# Altium schematic sheet SPI-UART.schdoc
size 497 x 243 mm; Name: A_A4; Symbol: A_A4; Device: A_A4; @Project Name: G031J6M6; REV: 1.0; Date: 2021-07-21; Sheet: 1/1; Draw By: timp2100; Company: BUAA; Convert to PCB: yes; Add into BOM: yes
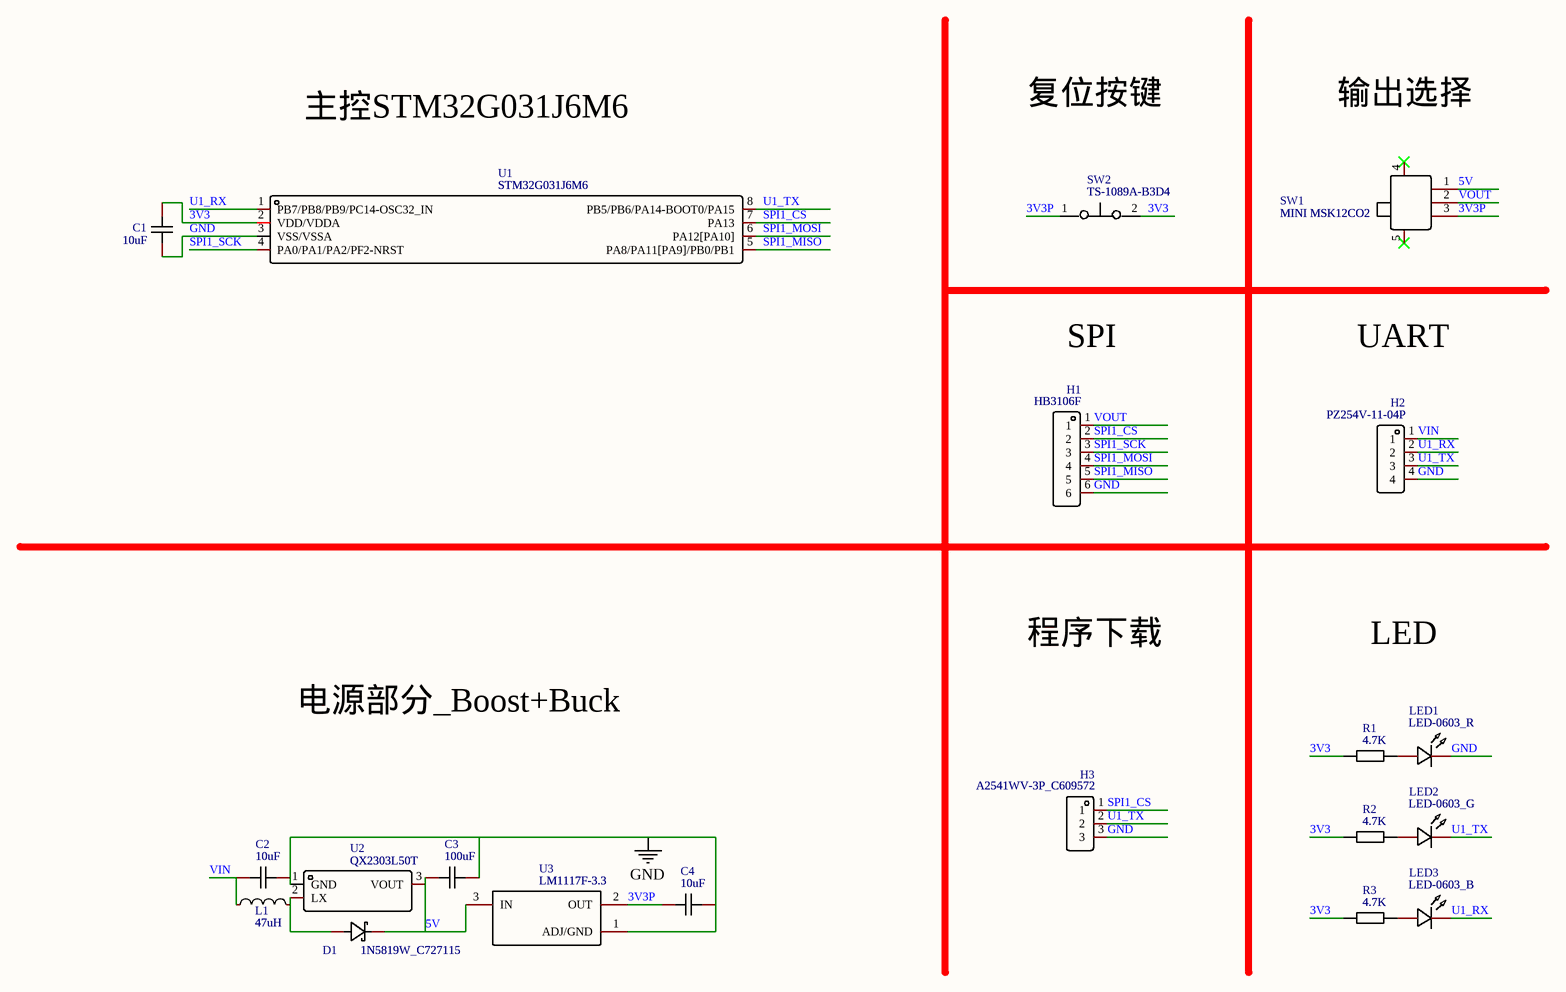
[diagram p0: SPI-UART.schdoc]

## Parts
C1  10uF  [C0402]
C2  10uF  [C0402]
C3  100uF  [C1206]
C4  10uF  [C0402]
D1  1N5819W_C727115  [SOD-123_L2.8-W1.8-LS3.7-RD]
H1  HB3106F  [HDR-TH_6P-P2.54-V-M]
H2  PZ254V-11-04P  [HDR-TH_4P-P2.54-V-M]
H3  A2541WV-3P_C609572  [HDR-TH_3P-P2.54-V-M]
L1  47uH  [IND-SMD_L6.0-W6.0]
LED1  LED-0603_R  [LED0603_RED]
LED2  LED-0603_G  [LED0603_GREEN]
LED3  LED-0603_B  [LED0603_BLUE]
R1  4.7K  [R0402]
R2  4.7K  [R0402]
R3  4.7K  [R0402]
SW1  MINI MSK12CO2  [SW-SMD_MSK12CO2]
SW2  TS-1089A-B3D4  [KEY-SMD_2P-L6.0-W3.8-P7.30-L]
U1  STM32G031J6M6  [SOIC-8_L4.9-W3.9-P1.27-LS6.0-BL]
U2  QX2303L50T  [SOT-23-3_L2.9-W1.6-P1.90-LS2.8-BR]
U3  LM1117F-3.3  [SOT-89_L4.5-W2.5-P1.50-LS4.2-BR]

## Nets
GND: C1.2 C2.2 C3.1 C4.2 H1.6 H2.4 H3.3 LED1.2 U1.3(VSS/VSSA) U2.1(GND) U3.1(ADJ/GND)
3V3: C1.1 R1.1 R2.1 R3.1 SW2.2 U1.2(VDD/VDDA)
3V3P: C4.1 SW1.3 SW2.1 U3.2(OUT)
5V: C3.2 D1.1(C) SW1.1 U2.3(VOUT) U3.3(IN)
SPI1_CS: H1.2 H3.1 U1.7(PA13)
SPI1_MISO: H1.5 U1.5(PA8/PA11[PA9]/PB0/PB1)
SPI1_MOSI: H1.4 U1.6(PA12[PA10])
SPI1_SCK: H1.3 U1.4(PA0/PA1/PA2/PF2-NRST)
U1_RX: H2.2 LED3.2 U1.1(PB7/PB8/PB9/PC14-OSC32_IN)
U1_TX: H2.3 H3.2 LED2.2 U1.8(PB5/PB6/PA14-BOOT0/PA15)
VIN: C2.1 H2.1 L1.1
VOUT: H1.1 SW1.2
NetD1_2: D1.2(A) L1.2 U2.2(LX)
NetLED1_1: LED1.1 R1.2
NetLED2_1: LED2.1 R2.2
NetLED3_1: LED3.1 R3.2

Not connected (* = marked no-connect by the designer): SW1 4* 5*

## Notes on the sheet
- 主控STM32G031J6M6
- 复位按键
- 输出选择
- SPI
- UART
- 程序下载
- LED
- 电源部分_Boost+Buck
- 1
- 2
- 3
- 4
- 5
- A
- B
- C
- D
- TITLE:
- G031J6M6
- REV:
- 1.0
- Date:
- Company:
- 2021-07-21
- BUAA
- Drawn By:
- timp2100
- Sheet:
- 1/1

## Library data of the parts
C1 C2 C4 = 10uF: Manufacturer: MuRata; Manufacturer Part: GRM155R61A106ME44D; 3DModel: C0402_L1.0-W0.5-H0.5; Add into BOM: yes; Name: 10uF; Symbol: 10uF; Device: 10uF; Supplier: LCSC; Supplier Part: C77000; JLCPCB Part Class: Extended Part; link: https://item.szlcsc.com/15869.html; Convert to PCB: yes; Origin Footprint: C0402
C3 = 100uF: Manufacturer: Murata Electronics; Manufacturer Part: GRM31CR61A107ME05L; 3DModel: C1206_L3.2-W1.6-H1.3; Add into BOM: yes; Name: 100uF; Symbol: 100uF; Device: 100uF; Supplier: LCSC; Supplier Part: C312983; JLCPCB Part Class: Extended Part; link: https://item.szlcsc.com/89171.html; Convert to PCB: yes; Origin Footprint: C1206
D1 = 1N5819W_C727115: Manufacturer: TWGMC; Add into BOM: yes; Name: 1N5819W_C727115; Symbol: 1N5819W_C727115; Device: 1N5819W_C727115; Supplier: LCSC; Supplier Part: C727115; Manufacturer Part: 1N5819W; JLCPCB Part Class: Extended Part; link: https://item.szlcsc.com/301422.html; 3DModel: SOD-123_L2.8-W1.8-LS3.7-RD; Convert to PCB: yes; Origin Footprint: SOD-123_L2.8-W1.8-LS3.7-RD
H1 = HB3106F: Manufacturer: FOXCONN(富士康); 3DModel: HDR-TH_6P-P2.54-M-LI-1X6P; Add into BOM: yes; Name: HB3106F; Symbol: HB3106F; Device: HB3106F; Supplier: LCSC; Supplier Part: C2761399; Manufacturer Part: HB3106F; JLCPCB Part Class: Extended Part; link: https://item.szlcsc.com/502961.html; Convert to PCB: yes; Origin Footprint: HDR-TH_6P-P2.54-V-M
H2 = PZ254V-11-04P: Manufacturer: XFCN; 3DModel: HDR-TH_4P-P2.54-M-LI-1X4P; Add into BOM: yes; Name: PZ254V-11-04P; Symbol: PZ254V-11-04P; Device: PZ254V-11-04P; Supplier: LCSC; Supplier Part: C492403; Manufacturer Part: PZ254V-11-04P; JLCPCB Part Class: Extended Part; link: https://item.szlcsc.com/502959.html; Convert to PCB: yes; Origin Footprint: HDR-TH_4P-P2.54-V-M
H3 = A2541WV-3P_C609572: Manufacturer: CJT(Changjiang Connectors); 3DModel: HDR-TH_3P-P2.54-M-LI-1X3P; Add into BOM: yes; Name: A2541WV-3P_C609572; Symbol: A2541WV-3P_C609572; Device: A2541WV-3P_C609572; Supplier: LCSC; Supplier Part: C609572; Manufacturer Part: A2541WV-3P; JLCPCB Part Class: Extended Part; link: https://item.szlcsc.com/502958.html; Convert to PCB: yes; Origin Footprint: HDR-TH_3P-P2.54-V-M
L1 = 47uH: Manufacturer: Taiyo Yuden; Manufacturer Part: NRS6012T470MMGJ; 3DModel: IND-SMD_L6.0-W6.0-H4.5; Add into BOM: yes; Name: 47uH; Symbol: 47uH; Device: 47uH; Supplier: LCSC; Supplier Part: C222972; JLCPCB Part Class: Extended Part; link: https://item.szlcsc.com/306512.html; Convert to PCB: yes; Origin Footprint: IND-SMD_L6.0-W6.0
LED1 = LED-0603_R: Manufacturer: EVERLIGHT(台湾亿光); Manufacturer Part: 19-217/R6C-AL1M2VY/3T; Add into BOM: yes; Name: LED-0603_R; Symbol: LED-0603_R; Device: LED-0603_R; Supplier Part: C72044; Supplier: LCSC; 3DModel: LED0603_Red; Convert to PCB: yes; Origin Footprint: LED0603_RED
LED2 = LED-0603_G: Manufacturer: EVERLIGHT(台湾亿光); Manufacturer Part: 19-217/GHC-YR1S2/3T; Add into BOM: yes; Name: LED-0603_G; Symbol: LED-0603_G; Device: LED-0603_G; Supplier Part: C72043; Supplier: LCSC; 3DModel: LED0603_Green; Convert to PCB: yes; Origin Footprint: LED0603_GREEN
LED3 = LED-0603_B: Manufacturer: EVERLIGHT(台湾亿光); Manufacturer Part: 19-217/BHC-ZL1M2RY/3T; Add into BOM: yes; Name: LED-0603_B; Symbol: LED-0603_B; Device: LED-0603_B; Supplier Part: C72041; Supplier: LCSC; 3DModel: LED0603_Blue; Convert to PCB: yes; Origin Footprint: LED0603_BLUE
R1-R3 = 4.7K: Manufacturer: UniOhm; Manufacturer Part: 0402WGJ0472TCE; 3DModel: R0402_L1.0-W0.5-H0.5; Add into BOM: yes; Name: 4.7K; Symbol: 4.7K; Device: 4.7K; Supplier: LCSC; Supplier Part: C25940; JLCPCB Part Class: Extended Part; link: https://item.szlcsc.com/323315.html; Convert to PCB: yes; Origin Footprint: R0402
SW1 = MINI MSK12CO2: Manufacturer: SHOU HAN(首韩); Add into BOM: yes; Name: MINI MSK12CO2; Symbol: MINI MSK12CO2; Device: MINI MSK12CO2; Supplier: LCSC; Supplier Part: C2681570; Manufacturer Part: MINI MSK12CO2; JLCPCB Part Class: Extended Part; link: https://item.szlcsc.com/2774913.html; 3DModel: SW-SMD_MSK12CO2; Convert to PCB: yes; Origin Footprint: SW-SMD_MSK12CO2
SW2 = TS-1089A-B3D4: 贴片1N4148; Manufacturer: Yuandi; 3DModel: KEY-SMD_2P-L6.0-W3.8-H2.5-LS7.30; Add into BOM: yes; Name: TS-1089A-B3D4; Symbol: TS-1089A-B3D4; Device: TS-1089A-B3D4; Supplier: LCSC; Supplier Part: C498305; Manufacturer Part: TS-1089A-B3D4; JLCPCB Part Class: Extended Part; link: https://so.szlcsc.com/global.html?c=&k=C221784; Convert to PCB: yes; Origin Footprint: KEY-SMD_2P-L6.0-W3.8-P7.30-L
U1 = STM32G031J6M6: Manufacturer: STMicroelectronics; 3DModel: SOIC-8_L4.9-W3.9-H1.7-LS6.0-P1.27; Add into BOM: yes; Name: STM32G031J6M6; Symbol: STM32G031J6M6; Device: STM32G031J6M6; Supplier: LCSC; Supplier Part: C432201; Manufacturer Part: STM32G031J6M6; JLCPCB Part Class: Extended Part; link: https://so.szlcsc.com/global.html?c=&k=C9843; Convert to PCB: yes; Origin Footprint: SOIC-8_L4.9-W3.9-P1.27-LS6.0-BL
U2 = QX2303L50T: Manufacturer: QX Micro Devices; 3DModel: SOT-23-3L_L2.9-W1.6-H1.1-LS2.8-P0.95; Add into BOM: yes; Name: QX2303L50T; Symbol: QX2303L50T; Device: QX2303L50T; Supplier: LCSC; Supplier Part: C219027; Manufacturer Part: QX2303L50T; JLCPCB Part Class: Extended Part; link: https://item.szlcsc.com/14454.html; Convert to PCB: yes; Origin Footprint: SOT-23-3_L2.9-W1.6-P1.90-LS2.8-BR
U3 = LM1117F-3.3: Manufacturer: HTC; 3DModel: SOT-89-3_L4.3-W2.5-H1.6-LS4.1-P1.50; Add into BOM: yes; Name: LM1117F-3.3; Symbol: LM1117F-3.3; Device: LM1117F-3.3; Supplier: LCSC; Manufacturer Part: LM1117F-3.3; Supplier Part: C126019; JLCPCB Part Class: Extended Part; link: https://item.szlcsc.com/236145.html; Convert to PCB: yes; Origin Footprint: SOT-89_L4.5-W2.5-P1.50-LS4.2-BR